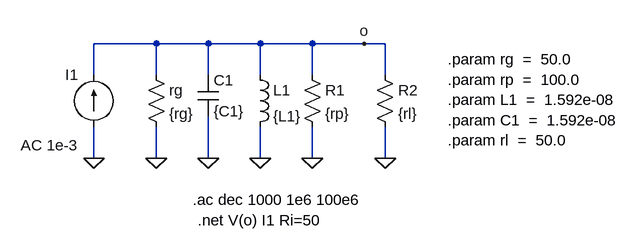
[diagram p0: schematic eje3.asc]
eje3.asc, the LTspice schematic file:
Version 4
SHEET 1 880 680
WIRE 64 64 -32 64
WIRE 144 64 64 64
WIRE 224 64 144 64
WIRE 304 64 224 64
WIRE 384 64 304 64
WIRE 416 64 384 64
WIRE -32 112 -32 64
WIRE 64 112 64 64
WIRE 144 112 144 64
WIRE 224 112 224 64
WIRE 304 112 304 64
WIRE 416 112 416 64
WIRE -32 240 -32 192
WIRE 64 240 64 192
WIRE 144 240 144 176
WIRE 224 240 224 192
WIRE 304 240 304 192
WIRE 416 240 416 192
FLAG -32 240 0
FLAG 64 240 0
FLAG 144 240 0
FLAG 224 240 0
FLAG 304 240 0
FLAG 416 240 0
FLAG 384 64 o
SYMBOL current -32 192 R180
WINDOW 0 24 80 Left 2
WINDOW 3 24 0 Left 2
WINDOW 123 24 -28 Left 2
WINDOW 39 0 0 Left 0
SYMATTR InstName I1
SYMATTR Value ""
SYMATTR Value2 AC 1e-3
SYMBOL ind 208 96 R0
SYMATTR InstName L1
SYMATTR Value {L1}
SYMBOL res 288 96 R0
SYMATTR InstName R1
SYMATTR Value {rp}
SYMBOL res 400 96 R0
SYMATTR InstName R2
SYMATTR Value {rl}
SYMBOL cap 128 112 R0
SYMATTR InstName C1
SYMATTR Value {C1}
SYMBOL res 48 96 R0
SYMATTR InstName rg
SYMATTR Value {rg}
TEXT 512 88 Left 2 !.param rg  =  50.0 \n.param rp  =  100.0 \n.param L1  =  1.592e-08 \n.param C1  =  1.592e-08 \n.param rl  =  50.0
TEXT 120 304 Left 2 !.ac dec 1000 1e6 100e6
TEXT 128 336 Left 2 !.net V(o) I1 Ri=50

The netlist it stands for:
* eje3.asc
I1 0 o AC 1e-3
L1 o 0 {L1}
R1 o 0 {rp}
R2 o 0 {rl}
C1 o 0 {C1}
rg o 0 {rg}
.param rg  =  50.0
.param rp  =  100.0
.param L1  =  1.592e-08
.param C1  =  1.592e-08
.param rl  =  50.0
.ac dec 1000 1e6 100e6
.net V(o) I1 Ri=50
.backanno
.end